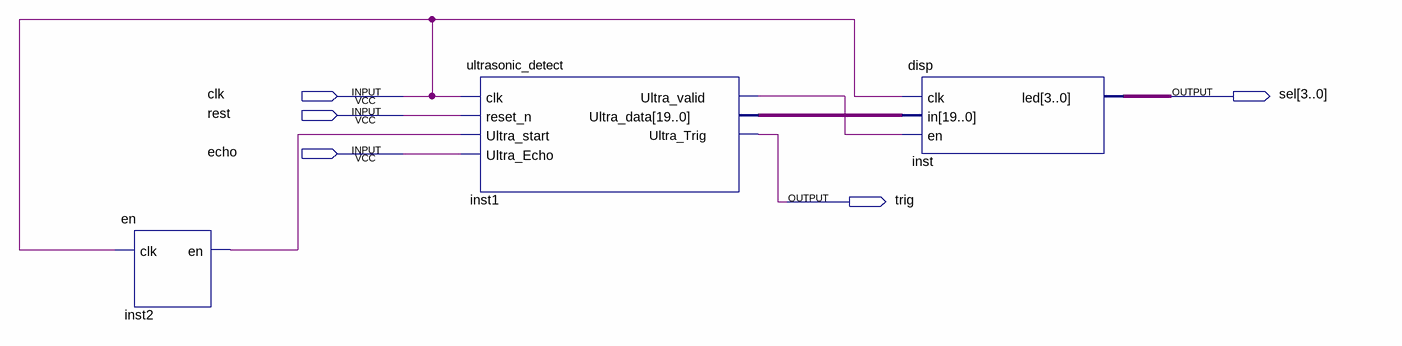
[diagram p0: schematic sheet]
// Quartus schematic tes.bdf as structural Verilog: 3 symbols, 5 pins
module tes (
  input  clk,
  input  rest,
  input  echo,
  output [3:0] sel,
  output trig
);

  wire inst1_ultra_valid, inst2_en;
  wire [19:0] inst1_ultra_data;

  en inst2 (.clk(clk), .en(inst2_en));
  ultrasonic_detect inst1 (
    .clk(clk), .reset_n(rest), .Ultra_start(inst2_en), .Ultra_Echo(echo), .Ultra_valid(inst1_ultra_valid),
    .Ultra_data(inst1_ultra_data), .Ultra_Trig(trig));
  disp inst (.clk(clk), .in(inst1_ultra_data), .en(inst1_ultra_valid), .led(sel));
endmodule
